# Altium schematic sheet Jlink OB.SchDoc
size A
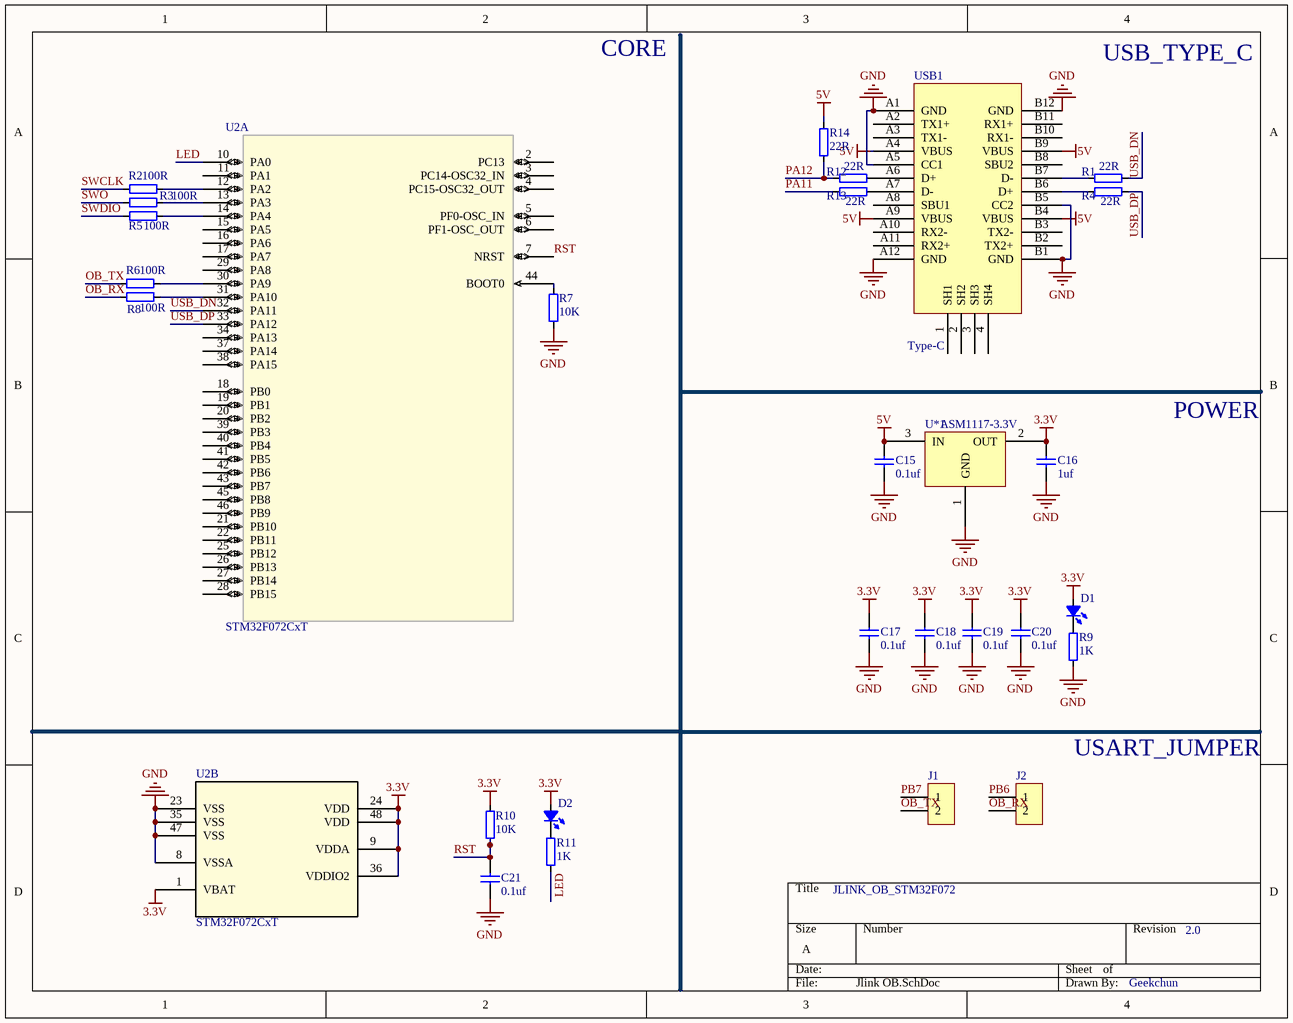
[diagram p0: Jlink OB.SchDoc]

## Parts
C15  0.1uf  [C 0603_L]
C16  1uf  [C 0603_L]
C17  0.1uf  [C 0603_L]
C18  0.1uf  [C 0603_L]
C19  0.1uf  [C 0603_L]
C20  0.1uf  [C 0603_L]
C21  0.1uf  [C 0603_L]
D1  LED_0603  [LED 0603B]  (value not drawn)
D2  LED_0603  [LED 0603B]  (value not drawn)
J1  USART JUMPER  [HDR2.54-LI-2P]  (value not drawn)
J2  USART JUMPER  [HDR2.54-LI-2P]  (value not drawn)
R1  22R  [R 0603_L]
R2  100R  [R 0603_L]
R3  100R  [R 0603_L]
R4  22R  [R 0603_L]
R5  100R  [R 0603_L]
R6  100R  [R 0603_L]
R7  10K  [R 0603_L]
R8  100R  [R 0603_L]
R9  1K  [R 0603_L]
R10  10K  [R 0603_L]
R11  1K  [R 0603_L]
R12  22R  [R 0603_L]
R13  22R  [R 0603_L]
R14  22R  [R 0603_L]
U2  STM32F072CxT  [LQFP48 7X7_L]  (parts A,B of 2)
U*1  ASM1117-3.3V  [SOT223_L]
USB1  Type-C  [usb typec]

## Nets
3.3V: C16.2 C17.2 C18.2 C19.2 C20.2 D1.1(A) D2.1(A) R10.2 U2.1(VBAT) U2.9(VDDA) U2.24(VDD) U2.36(VDDIO2) U2.48(VDD) U*1.2(OUT)
5V: C15.2 R14.2 U*1.3(IN) USB1.A4(VBUS) USB1.A9(VBUS) USB1.B4(VBUS) USB1.B9(VBUS)
GND: C15.1 C16.1 C17.1 C18.1 C19.1 C20.1 C21.1 R7.2 R9.1 U2.8(VSSA) U2.23(VSS) U2.35(VSS) U2.47(VSS) U*1.1(GND) USB1.A1(GND) USB1.A5(CC1) USB1.A12(GND) USB1.B1(GND) USB1.B5(CC2) USB1.B12(GND)
LED: R11.1 U2.10(PA0)
OB_RX: J2.2 R8.1
OB_TX: J1.2 R6.1
PA11: R13.1
PA12: R12.1 R14.1
PB6: J2.1
PB7: J1.1
RST: C21.2 R10.1 U2.7(NRST)
SWCLK: R2.1
SWDIO: R5.1
SWO: R3.1
USB_DN: R1.2 U2.32(PA11)
USB_DP: R4.2 U2.33(PA12)
NetD1_2: D1.2(K) R9.2
NetD2_2: D2.2(K) R11.2
NetR1_1: R1.1 USB1.B7(D-)
NetR2_2: R2.2 U2.12(PA2)
NetR3_2: R3.2 U2.13(PA3)
NetR4_1: R4.1 USB1.B6(D+)
NetR5_2: R5.2 U2.14(PA4)
NetR6_2: R6.2 U2.30(PA9)
NetR7_1: R7.1 U2.44(BOOT0)
NetR8_2: R8.2 U2.31(PA10)
NetR12_2: R12.2 USB1.A6(D+)
NetR13_2: R13.2 USB1.A7(D-)

Not connected (* = marked no-connect by the designer): U2 2(PC13) 3(PC14-OSC32_IN) 4(PC15-OSC32_OUT) 5(PF0-OSC_IN) 6(PF1-OSC_OUT) 11(PA1) 15(PA5) 16(PA6) 17(PA7) 18(PB0) 19(PB1) 20(PB2) 21(PB10) 22(PB11) 25(PB12) 26(PB13) 27(PB14) 28(PB15) 29(PA8) 34(PA13) 37(PA14) 38(PA15) 39(PB3) 40(PB4) 41(PB5) 42(PB6) 43(PB7) 45(PB8) 46(PB9); USB1 1(SH1) 2(SH2) 3(SH3) 4(SH4) A2(TX1+) A3(TX1-) A8(SBU1) A10(RX2-) A11(RX2+) B2(TX2+) B3(TX2-) B8(SBU2) B10(RX1-) B11(RX1+)

## Notes on the sheet
- CORE
- USB_TYPE_C
- POWER
- USART_JUMPER
- JLINK_OB_STM32F072
- 2.0
- Geekchun

## Library data of the parts
C15-C21 = CAP: Capacitor, NP0, ?.1pF; Part Number: C0402-1.2p; Value: 1.2pF; Note: 50V; Artikkelnr Noca: 20029157; Artikkelnr Simpro: N.A.; Manufacturer: *; Manufacturer Part Number: *; Datasheet: *; LatestRevisionDate: 2011-05-11; Pin Count: 2; Publisher: Nordic Semiconductor; Published: 2009-05-08; Supplier: *; Supplier part number: *; 2nd source Supplier: *; 2nd source part number: *; Footprint Doc: 0402
D1 D2 = LED_0603: LED
J1 J2 = CON2: Connector
R1-R14 = RES
U2 = STM32F072CxT: Imported; Vendor: STMicroelectronics; C: Copyright (C) 2016 Accelerated Designs. All rights reserved; Copyright: Copyright (C) 2016 Accelerated Designs. All rights reserved; Manufacturer_Part_Number: stm32f072cxt; RefDes: RefDes; Type: Type; Value: Value
U*1 = ASM1117-3.3V: 三端可调或固定电压3.3V